# Altium project PCB_Project.PrjPcb
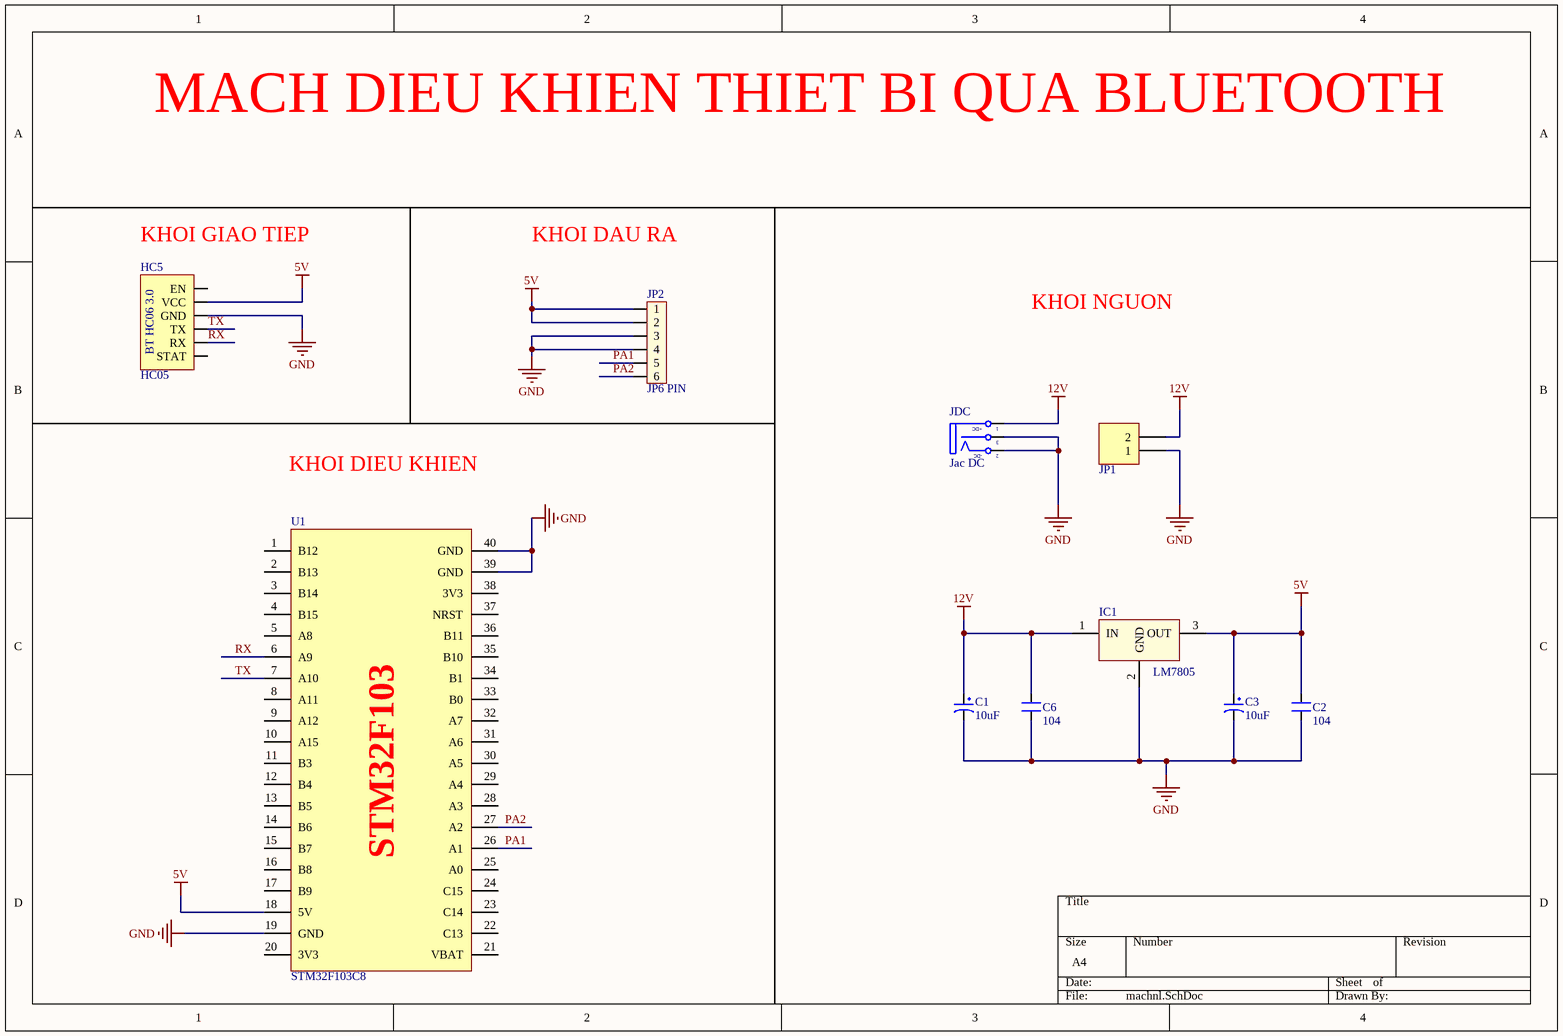
[diagram p0: machnl.SchDoc]
1 sheet, 10 parts. Net scope: global (net labels, ports and power ports of the same name join across sheets).
Board file: machin.PcbDoc

## Sheet machnl.SchDoc
size A4; SheetNumber: 1; SheetTotal: 1

### Parts
C1  10uF  [CP1/2]
C2  104  [CN2]
C3  10uF  [CP1/2]
C6  104  [CN2]
HC5  HC05  [HC06]
IC1  LM7805  [QTO-220]
JDC  Jac DC  [DC-IN]
JP1  Header 2_1  [HED2]  (value not drawn)
JP2  JP6 PIN  [JP6]
U1  STM32F103C8  [STM32F103C8]

### Nets
5V: C2.2 C3.1 HC5.5(VCC) IC1.3(OUT) JP2.1 JP2.2 U1.18(5V)
12V: C1.1 C6.2 IC1.1(IN) JDC.1(T) JP1.2
GND: C1.2 C2.1 C3.2 C6.1 HC5.4(GND) IC1.2(GND) JDC.2(TN) JDC.3(S) JP1.1 JP2.3 JP2.4 U1.19(GND) U1.39(GND) U1.40(GND)
PA1: JP2.5 U1.26(A1)
PA2: JP2.6 U1.27(A2)
RX: HC5.2(RX) U1.6(A9)
TX: HC5.3(TX) U1.7(A10)

Not connected (* = marked no-connect by the designer): HC5 1(STAT) 6(EN); U1 1(B12) 2(B13) 3(B14) 4(B15) 5(A8) 8(A11) 9(A12) 10(A15) 11(B3) 12(B4) 13(B5) 14(B6) 15(B7) 16(B8) 17(B9) 20(3V3) 21(VBAT) 22(C13) 23(C14) 24(C15) 25(A0) 28(A3) 29(A4) 30(A5) 31(A6) 32(A7) 33(B0) 34(B1) 35(B10) 36(B11) 37(NRST) 38(3V3)

### Notes on the sheet
- MACH DIEU KHIEN THIET BI QUA BLUETOOTH
- (near HC5) KHOI GIAO TIEP
- KHOI DAU RA
- KHOI NGUON
- KHOI DIEU KHIEN
- (in symbol DCIN) +DC; -DC
- (in symbol HC06) BT HC06 3.0
- (in symbol STM32F103C8T6) STM32F103

### Library data of the parts
C1 C3 = CP1: Cap P  0,1uF < 22uF , 16 - 50V; Value: 10uF/50V; Description 1: 10 => 220uF/6,3V/10V - 10uF => 100uF/16V; Description 2: 0,1uF => 33uF/50V - 10uF => 22uF/63V; Description 3: 0,47uF => 10uF/100V
C2 C6 = CN2: Cap np 104 => 105pF; Value: 0.1uF
HC5 = HC06: Manufacturer: W¨¹rth Elektronik eiSos GmbH; partNo: 613004143121; ComponentLink1 Description: Manufacturer; ComponentLink2 Description: Datasheet; NoPins: 04; Created Date: 29 March 2013; ComponentLink1URL: http://www.we-online.com; ComponentLink2URL: http://katalog.we-online.de/em/datasheet/6130xx143121.pdf; Created by: Karrer Zheng
IC1 = LM78xx: On ap +, from + 5 to + 24VDC; Value: LM7805
JDC = DCIN: Jac DC input; Value: Jac DC
JP1 = Header 2_1: Header, 2-Pin; Manufacturer: Generic Components; Class: Connector; Value: Header 2
JP2 = JP6: Value: JP7
U1 = STM32F103C8T6